# EAGLE design shield_template (EAGLE 6.2)
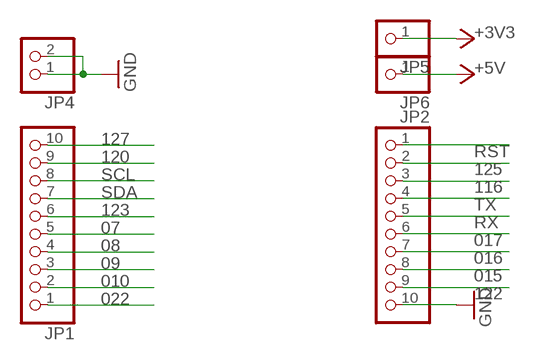
[diagram p0: schematic, sheet 1]

## Parts
JP1  PINHD-1X10_2.54  [1X10]
JP2  PINHD-1X10_2.54  [1X10]
JP4  PINHD-1X02_2.54  [1X02]
JP5  PINHD-1X1  [1X01]
JP6  PINHD-1X1  [1X01]

## Nets
07: JP1.5
08: JP1.4
09: JP1.3
010: JP1.2
015: JP2.8
016: JP2.7
017: JP2.6
022: JP1.1
116: JP2.3
120: JP1.9
122: JP2.9
123: JP1.6
125: JP2.2
127: JP1.10
+3V3: JP5.1
+5V: JP6.1
GND: JP2.10 JP4.1 JP4.2
RST: JP2.1
RX: JP2.5
SCL: JP1.8
SDA: JP1.7
TX: JP2.4

## Library data of the parts
JP1 JP2 = pinhead-2:PINHD-1X10: PIN HEADER
JP4 = pinhead-2:PINHD-1X02: PIN HEADER
JP5 JP6 = pinhead:PINHD-1X1: PIN HEADER

## Board
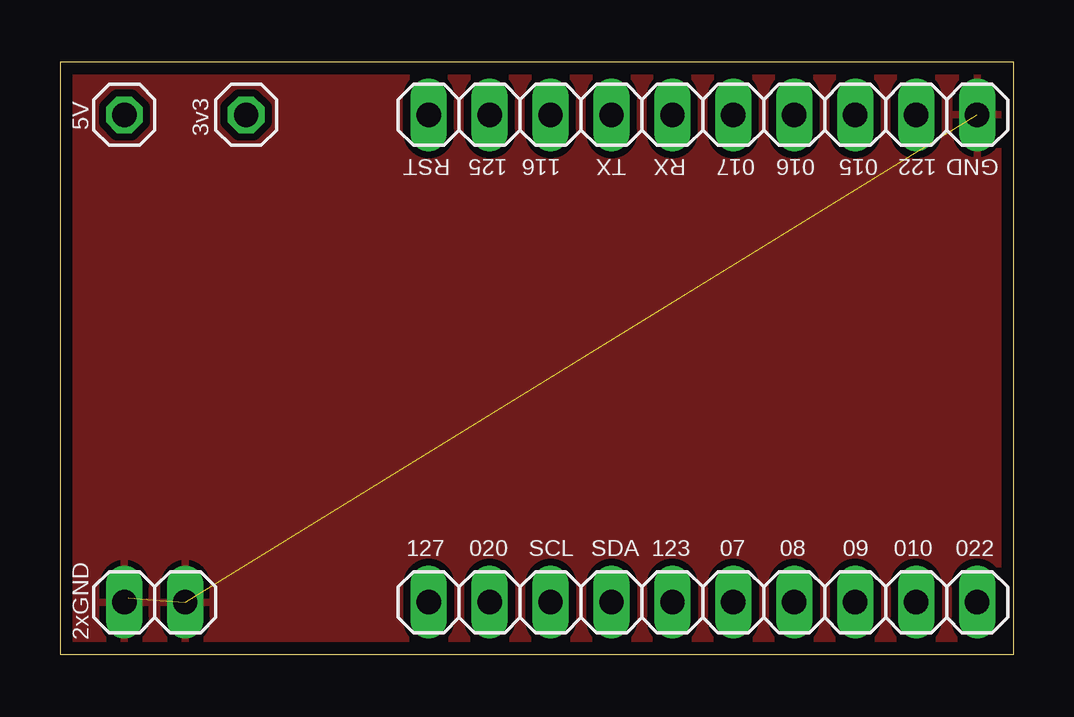
[diagram p1: board, top side]
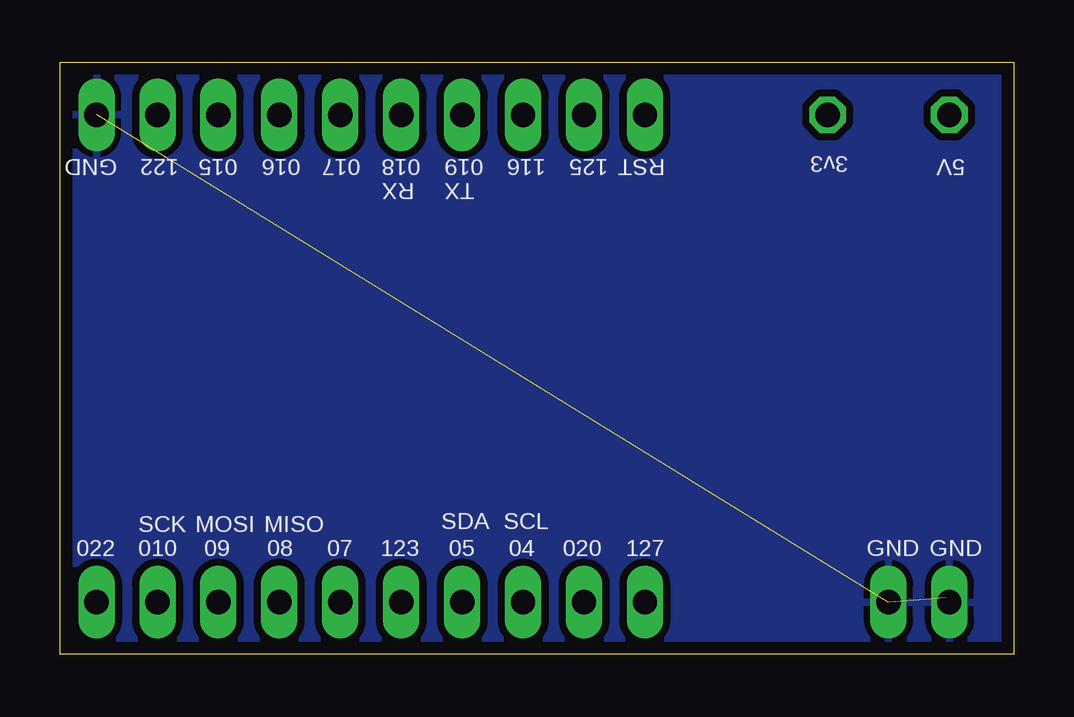
[diagram p2: board, bottom side, seen from below]

Size 39.75 x 24.67 mm. Coordinates in mm from the lower left corner, seen from the top.
Outline: 0,0 39.75,0 39.75,24.67 0,24.67 0,0
Copper layers (1*16): Top 0.035mm / dielectric 1.5mm / Bottom 0.035mm
Design rules: minimum track width 8mil, minimum drill 0.4mm, track to track 8mil, track to pad 8mil, pad to pad 8mil, via to via 8mil, smd to smd 8mil, copper to edge 20mil, drill to drill 8mil, minimum pad ring 10mil, minimum via ring 8mil, stop-mask expansion 4mil, vias tented up to drill 40mil, thermal gap 10mil

### Footprints (pad centres in the part's own frame; a part is rotated, then mirrored left to right if it is on the bottom)
1X10 = drill 1.016 long: 1 -11.43,0; 2 -8.89,0; 3 -6.35,0; 4 -3.81,0; 5 -1.27,0; 6 1.27,0; 7 3.81,0; 8 6.35,0; 9 8.89,0; 10 11.43,0
1X02 = drill 1.016 long: 1 -1.27,0; 2 1.27,0
1X01 = drill 1.016 octagon: 1 0,0

### Placement (x,y rotation side)
JP1  26.8,2.17 180 top
JP2  26.8,22.48 0 top
JP4  3.95,2.17 0 top
JP5  7.76,22.48 0 top
JP6  2.68,22.48 0 top

### Tracks (layer width: path | path; a pad name or v marks a point on that pad's centre or on a via)
07
  Top 0.254: JP1.5 27.53,2.81 27.55,2.83
123
  Top 0.254: JP1.6 25.05,2.65
GND  (2 unrouted)
  Top 0.813: JP4.1 2.85,2.33
  pour Top (isolate 0.305): -0.15,0.4 39.75,0.28 39.75,24.77 -0.15,24.9
  pour Bottom (isolate 0.305): -0.18,0.4 39.75,0.28 39.75,24.77 -0.18,24.9

### Text on the board
tNames: 5V | 3v3 | RST | 125 | 116 | TX | RX | 017 | 016 | 015 | 122 | GND | 127 | 020 | SCL | SDA | 123 | 07 | 08 | 09 | 010 | 022 | 2xGND
bNames: 5V | 3v3 | RST | 125 | 116 | 019 | 018 | 017 | 016 | 015 | 122 | GND | TX | RX | SCL | SDA | MISO | MOSI | SCK | GND | GND | 127 | 020 | 04 | 05 | 123 | 07 | 08 | 09 | 010 | 022